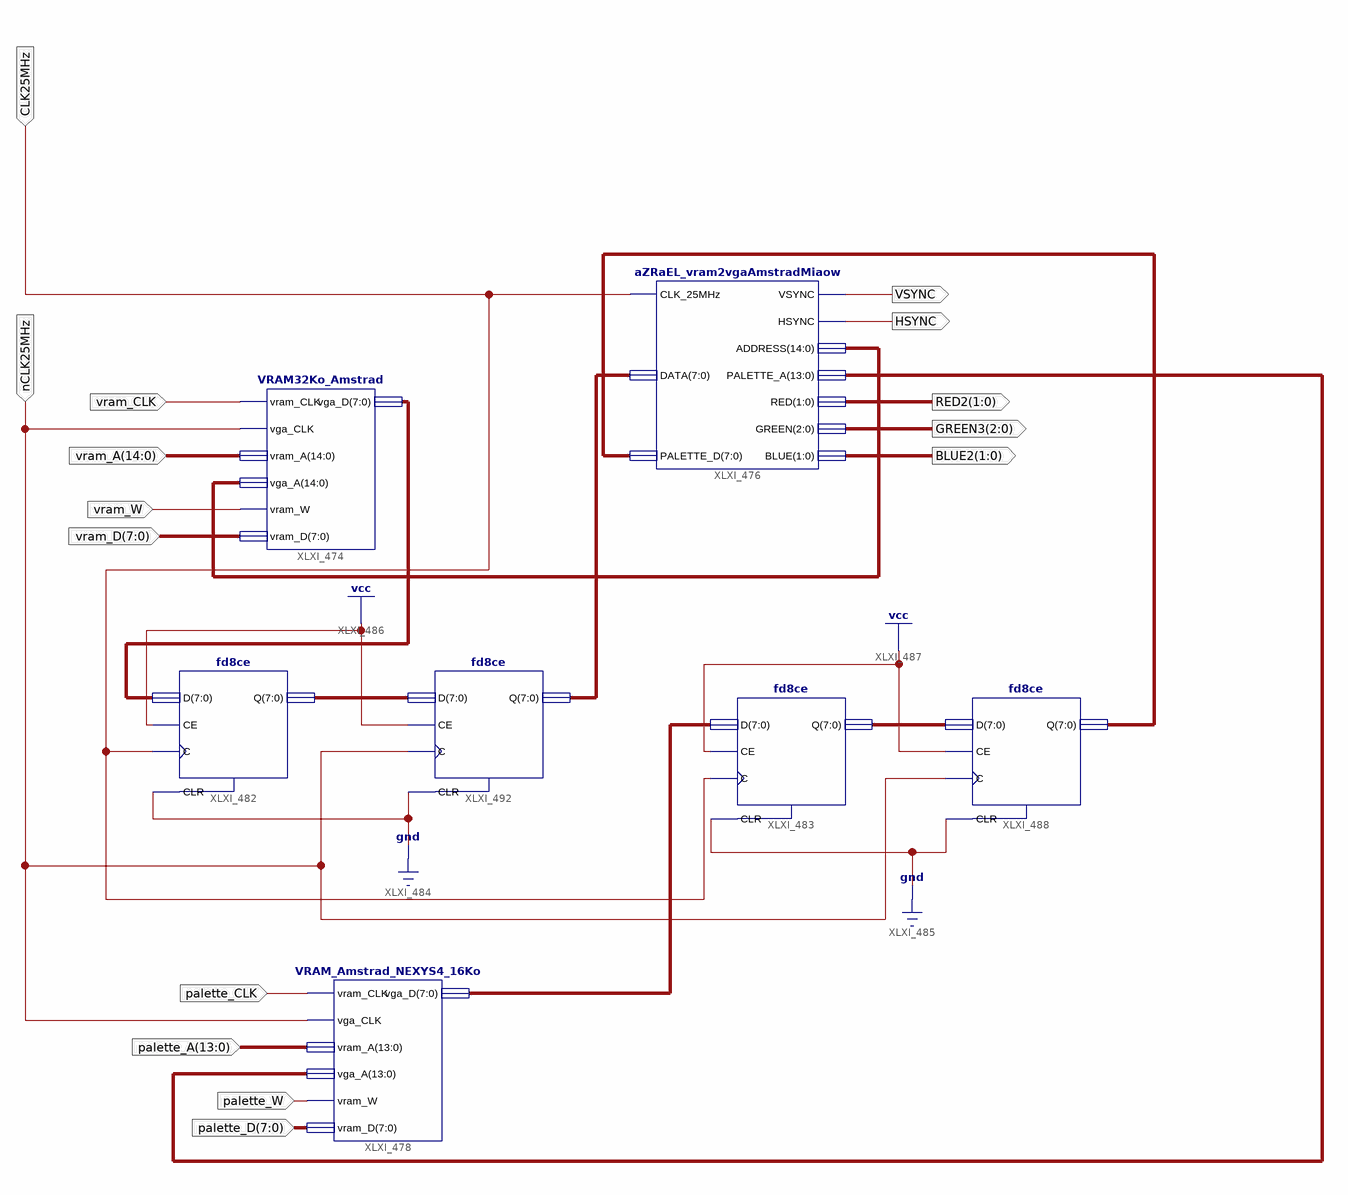
[diagram p0: schematic sheet 1]
// Xilinx ISE schematic amstrad_video.sch (artix7) as structural Verilog: 7 symbols, 15 ports
module amstrad_video (
  input  vram_W,
  input  [7:0] vram_D,
  input  [14:0] vram_A,
  input  vram_CLK,
  input  CLK25MHz,
  input  palette_W,
  input  [7:0] palette_D,
  input  [13:0] palette_A,
  input  palette_CLK,
  input  nCLK25MHz,
  output HSYNC,
  output VSYNC,
  output [1:0] RED2,
  output [2:0] GREEN3,
  output [1:0] BLUE2
);

  wire [7:0] XLXN_713, XLXN_715, XLXN_724, XLXN_738, XLXN_743, XLXN_744;
  wire [13:0] XLXN_694;
  wire [14:0] XLXN_693;

  VRAM32Ko_Amstrad XLXI_474 (
    .vram_CLK(vram_CLK), .vga_CLK(nCLK25MHz), .vram_A(vram_A), .vga_A(XLXN_693), .vram_W(vram_W),
    .vram_D(vram_D), .vga_D(XLXN_713));
  aZRaEL_vram2vgaAmstradMiaow XLXI_476 (
    .CLK_25MHz(CLK25MHz), .DATA(XLXN_743), .PALETTE_D(XLXN_744), .VSYNC(VSYNC), .HSYNC(HSYNC),
    .ADDRESS(XLXN_693), .PALETTE_A(XLXN_694), .RED(RED2), .GREEN(GREEN3), .BLUE(BLUE2));
  VRAM_Amstrad_NEXYS4_16Ko XLXI_478 (
    .vram_CLK(palette_CLK), .vga_CLK(nCLK25MHz), .vram_A(palette_A), .vga_A(XLXN_694), .vram_W(palette_W),
    .vram_D(palette_D), .vga_D(XLXN_715));
  fd8ce XLXI_482 (.C(CLK25MHz), .CE(1'b1), .CLR(1'b0), .D(XLXN_713), .Q(XLXN_738));
  fd8ce XLXI_483 (.C(CLK25MHz), .CE(1'b1), .CLR(1'b0), .D(XLXN_715), .Q(XLXN_724));
  fd8ce XLXI_488 (.C(nCLK25MHz), .CE(1'b1), .CLR(1'b0), .D(XLXN_724), .Q(XLXN_744));
  fd8ce XLXI_492 (.C(nCLK25MHz), .CE(1'b1), .CLR(1'b0), .D(XLXN_738), .Q(XLXN_743));
endmodule
